# EAGLE design RevA (EAGLE 7.0.0)
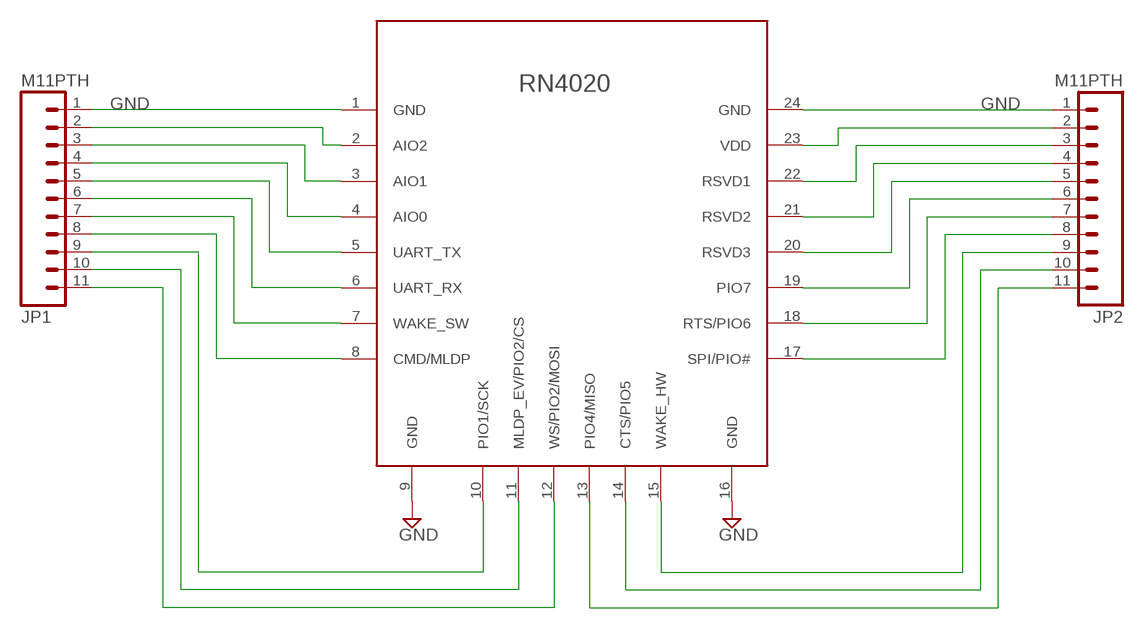
[diagram p0: schematic, sheet 1]

## Parts
JP1  M11PTH  [1X11]
JP2  M11PTH  [1X11]
U$1  RN4020  [RN4020]

## Nets
GND: JP1.1 JP2.1 U$1.1(GND) U$1.9(GND) U$1.16(GND) U$1.24(GND)
N$2: JP1.2 U$1.2(AIO2)
N$3: JP1.3 U$1.3(AIO1)
N$4: JP1.4 U$1.4(AIO0)
N$5: JP1.5 U$1.5(UART_TX)
N$6: JP1.6 U$1.6(UART_RX)
N$7: JP1.7 U$1.7(WAKE_SW)
N$8: JP1.8 U$1.8(CMD/MLDP)
N$9: JP1.9 U$1.10(PIO1/SCK)
N$10: JP1.10 U$1.11(MLDP_EV/PIO2/CS)
N$11: JP1.11 U$1.12(WS/PIO2/MOSI)
N$13: JP2.3 U$1.22(RSVD1)
N$14: JP2.4 U$1.21(RSVD2)
N$15: JP2.5 U$1.20(RSVD3)
N$16: JP2.6 U$1.19(PIO7)
N$17: JP2.7 U$1.18(RTS/PIO6)
N$18: JP2.8 U$1.17(SPI/PIO#)
N$19: JP2.9 U$1.15(WAKE_HW)
N$20: JP2.10 U$1.14(CTS/PIO5)
N$21: JP2.11 U$1.13(PIO4/MISO)
VDD: JP2.2 U$1.23(VDD)

## Library data of the parts
JP1 JP2 = SparkFun-Connectors:M11: Header 11 Standard 11-pin 0.1" header. Use with straight break away headers (SKU : PRT-00116), right angle break away headers (PRT-00553), swiss pins (PRT-00743), machine pins (PRT-00117), and female headers (PRT-00115).
U$1 = microchip:RN4020

## Board
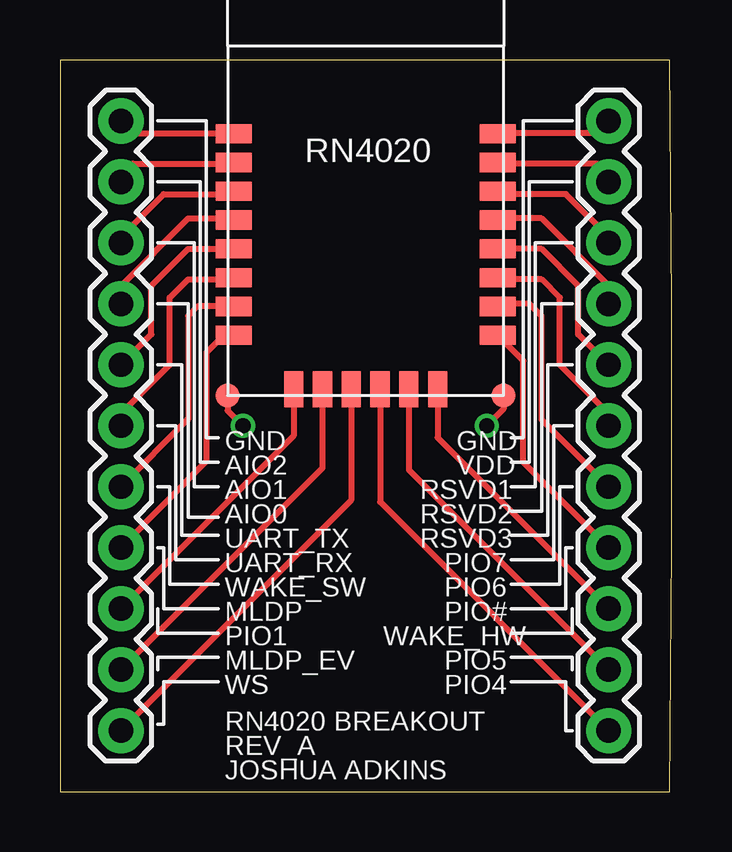
[diagram p1: board, top side]
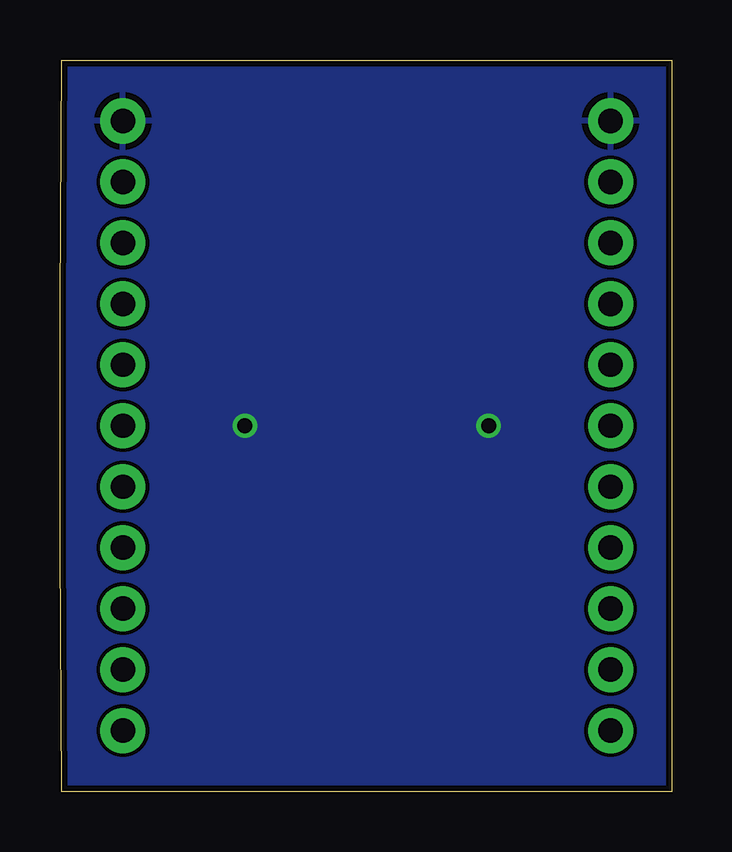
[diagram p2: board, bottom side, seen from below]

Size 25.48 x 30.48 mm. Coordinates in mm from the lower left corner, seen from the top.
Outline: 0,0 25.4,0 arc1 25.4,30.48 0,30.48 0,0
Copper layers (1*16): Top 0.035mm / dielectric 1.5mm / Bottom 0.035mm
Design rules "ITEADstudio_DRC": minimum track width 6mil, minimum drill 12mil, track to track 6mil, track to pad 6mil, pad to pad 6mil, via to via 6mil, smd to smd 0mil, copper to edge 10mil, drill to drill 10mil, minimum pad ring 10mil, minimum via ring 6mil, stop-mask expansion 2mil, vias tented up to drill 100mil, thermal gap 10mil

### Footprints (pad centres in the part's own frame; a part is rotated, then mirrored left to right if it is on the bottom)
1X11 = drill 1.016 pad 1.88: 1 0,0; 2 2.54,0; 3 5.08,0; 4 7.62,0; 5 10.16,0; 6 12.7,0; 7 15.24,0; 8 17.78,0; 9 20.32,0; 10 22.86,0; 11 25.4,0
RN4020 = smd 1.5 x 0.8: 1 0.25,10.9; 2 0.25,9.7; 3 0.25,8.5; 4 0.25,7.3; 5 0.25,6.1; 6 0.25,4.9; 7 0.25,3.7; 8 0.25,2.5; 17 11.25,2.5; 18 11.25,3.7; 19 11.25,4.9; 20 11.25,6.1; 21 11.25,7.3; 22 11.25,8.5; 23 11.25,9.7; 24 11.25,10.9 | smd 1 x 1: 9 0,0; 16 11.5,0 | smd 0.8 x 1.5: 10 2.75,0.25; 11 3.95,0.25; 12 5.15,0.25; 13 6.35,0.25; 14 7.55,0.25; 15 8.75,0.25

### Placement (x,y rotation side)
JP1  2.54,27.94 270 top
JP2  22.86,27.94 270 top
U$1  6.99,16.51 0 top

### Tracks (layer width: path | path; a pad name or v marks a point on that pad's centre or on a via)
GND  (via drill 0.64 pad 1.02)
  Top 0.254: U$1.1 3.03,27.41 JP1.1 | U$1.9 6.99,15.88 v7.62,15.24 | U$1.16 18.48,15.95 v17.78,15.24 | JP2.1 22.35,27.43 18.26,27.43 U$1.24
  pour Bottom: 0.25,0.25 0.25,30.23 25.15,30.23 25.15,0.25
N$2
  Top 0.254: JP1.2 2.5,25.61 3.05,26.16 7.19,26.16 U$1.2
N$3
  Top 0.254: JP1.3 2.5,23.07 4.32,24.89 7.12,24.89 U$1.3
N$4
  Top 0.254: JP1.4 2.5,21.04 5.33,23.88 7.17,23.88 U$1.4
N$5
  Top 0.254: JP1.5 3.81,19.05 3.81,21.08 5.33,22.61 U$1.5
N$6
  Top 0.254: JP1.6 2.54,15.75 4.57,17.78 4.57,20.57 5.33,21.34 7.16,21.34 U$1.6
N$7
  Top 0.254: U$1.7 5.73,20.21 5.33,19.81 5.33,15.49 5.29,15.49 JP1.7 2.54,12.74
N$8
  Top 0.254: U$1.8 6.82,19.01 6.1,18.29 6.1,13.76 JP1.8
N$9
  Top 0.254: U$1.10 9.73,14.81 JP1.9
N$10
  Top 0.254: U$1.11 10.94,13.47 JP1.10
N$11
  Top 0.254: U$1.12 12.13,12.13 JP1.11
N$13
  Top 0.254: JP2.3 22.86,23.11 21.08,24.89 18.35,24.89 U$1.22
N$14
  Top 0.254: JP2.4 22.86,21.08 20.07,23.88 18.3,23.88 U$1.21
N$15
  Top 0.254: JP2.5 21.59,19.05 21.59,21.08 20.07,22.61 U$1.20
N$16
  Top 0.254: JP2.6 22.86,15.75 20.83,17.78 20.83,20.57 20.07,21.34 18.31,21.34 U$1.19
N$17
  Top 0.254: JP2.7 20.07,15.49 20.07,19.81 19.56,20.32 18.29,20.32 U$1.18
N$18
  Top 0.254: JP2.8 19.3,13.72 19.3,17.94 U$1.17
N$19
  Top 0.254: U$1.15 15.73,14.74 JP2.9
N$20
  Top 0.254: U$1.14 14.54,13.4 JP2.10
N$21
  Top 0.254: U$1.13 13.34,12.06 JP2.11
VDD
  Top 0.254: JP2.2 22.86,25.65 22.35,26.16 18.28,26.16 U$1.23

### Text on the board
tNames: GND | GND | AIO2 | VDD | AIO1 | RSVD1 | AIO0 | RSVD2 | UART_TX | RSVD3 | UART_RX | PIO7 | WAKE_SW | PIO6 | MLDP | PIO# | PIO1 | WAKE_HW | MLDP_EV | PIO5 | WS | PIO4 | RN4020 BREAKOUT | REV_A | JOSHUA ADKINS